# Altium schematic sheet Flash Programmer.SchDoc
size A4; SheetNumber: 4; SheetTotal: 9
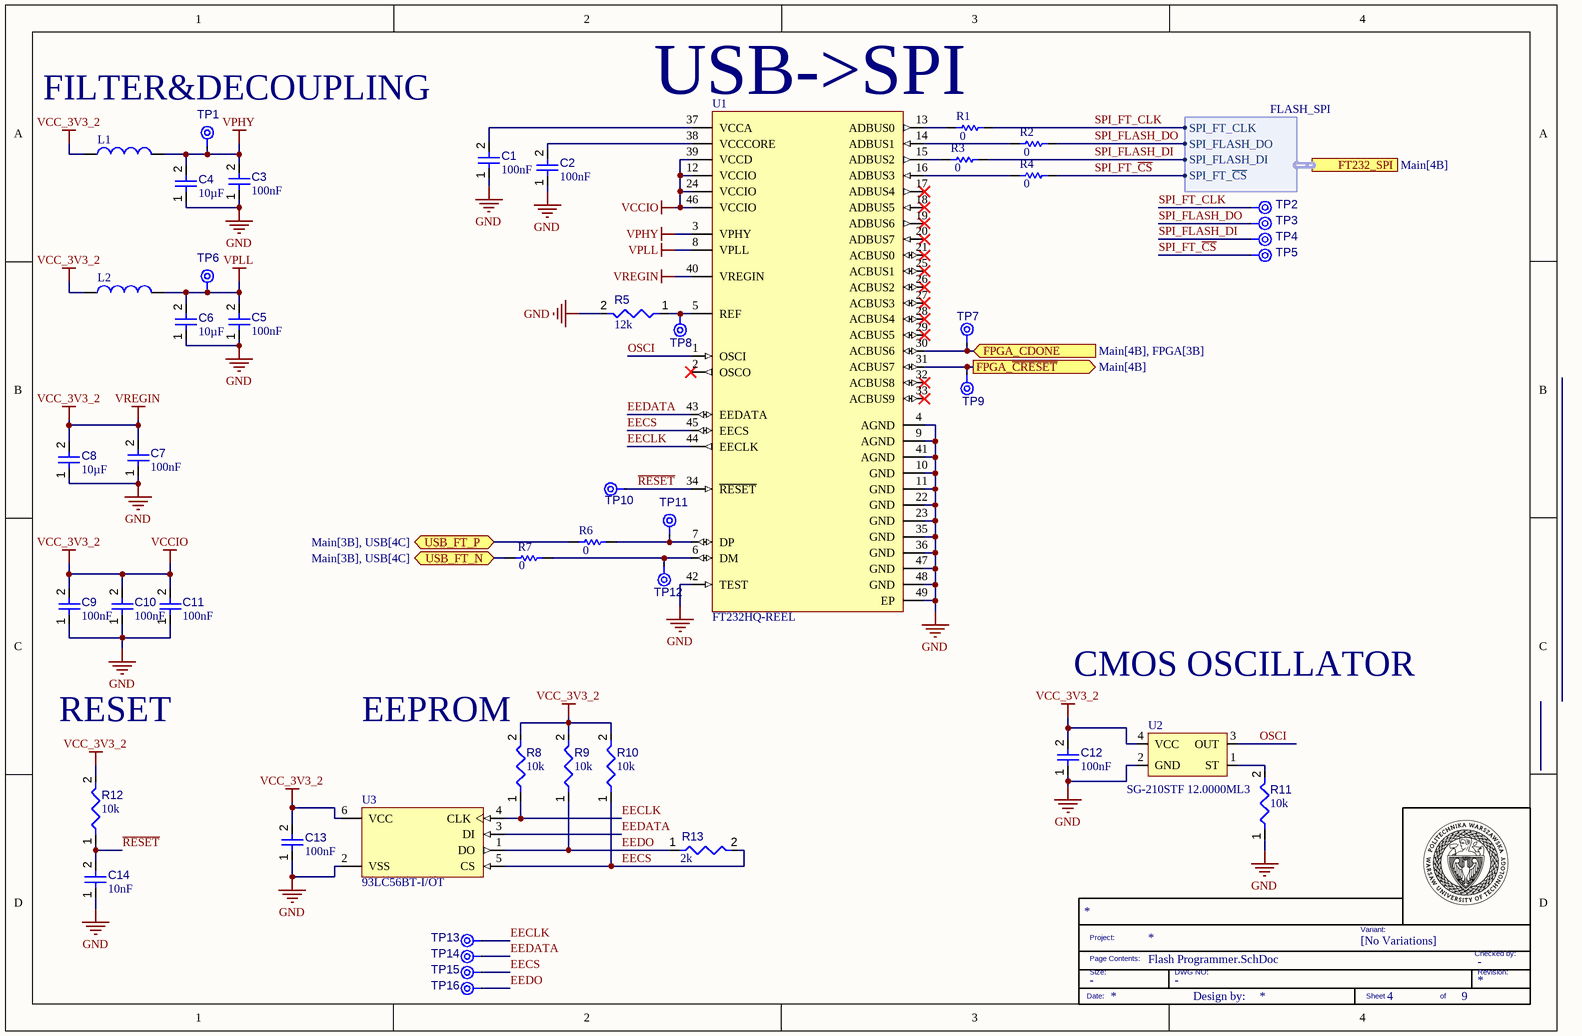
[diagram p0: Flash Programmer.SchDoc]

## Parts
*?  TITLE_BLOCK  (value not drawn)  (graphical)
C1  value 100nF  [FP-C0603C-CF-IPC_C]  (hidden comment: C0603C104K5RAC7411)
C2  value 100nF  [FP-C0603C-CF-IPC_C]  (hidden comment: C0603C104K5RAC7411)
C3  value 100nF  [FP-C0603C-CF-IPC_C]  (hidden comment: C0603C104K5RAC7411)
C4  value 10µF  [FP-GRM188-0_2-IPC_C]  (hidden comment: GRM188R61C106MA73D)
C5  value 100nF  [FP-C0603C-CF-IPC_C]  (hidden comment: C0603C104K5RAC7411)
C6  value 10µF  [FP-GRM188-0_2-IPC_C]  (hidden comment: GRM188R61C106MA73D)
C7  value 100nF  [FP-C0603C-CF-IPC_C]  (hidden comment: C0603C104K5RAC7411)
C8  value 10µF  [FP-GRM188-0_2-IPC_C]  (hidden comment: GRM188R61C106MA73D)
C9  value 100nF  [FP-C0603C-CF-IPC_C]  (hidden comment: C0603C104K5RAC7411)
C10  value 100nF  [FP-C0603C-CF-IPC_C]  (hidden comment: C0603C104K5RAC7411)
C11  value 100nF  [FP-C0603C-CF-IPC_C]  (hidden comment: C0603C104K5RAC7411)
C12  value 100nF  [FP-C0603C-CF-IPC_C]  (hidden comment: C0603C104K5RAC7411)
C13  value 100nF  [FP-C0603C-CF-IPC_C]  (hidden comment: C0603C104K5RAC7411)
C14  value 10nF  [CAPC1608X90X35LL10T15]  (hidden comment: GCM188R71H103KA37J)
L1  MPZ1608Y101BTA00  [FP-MPZ1608-0_8-IPC_C]  (value not drawn)
L2  MPZ1608Y101BTA00  [FP-MPZ1608-0_8-IPC_C]  (value not drawn)
R1  value 0  [RESC1005X40X25ML05T10]  (hidden comment: Resistor 0R 0402 63 mW)
R2  value 0  [RESC1005X40X25ML05T10]  (hidden comment: Resistor 0R 0402 63 mW)
R3  value 0  [RESC1005X40X25ML05T10]  (hidden comment: Resistor 0R 0402 63 mW)
R4  value 0  [RESC1005X40X25ML05T10]  (hidden comment: Resistor 0R 0402 63 mW)
R5  value 12k  [RESC1608X06N]  (hidden comment: RCS060312K0FKEA)
R6  value 0  [RESC1005X40X25ML05T10]  (hidden comment: Resistor 0R 0402 63 mW)
R7  value 0  [RESC1005X40X25ML05T10]  (hidden comment: Resistor 0R 0402 63 mW)
R8  value 10k  [RESC1608X05N]  (hidden comment: CRCW060310K0FKTC)
R9  value 10k  [RESC1608X05N]  (hidden comment: CRCW060310K0FKTC)
R10  value 10k  [RESC1608X05N]  (hidden comment: CRCW060310K0FKTC)
R11  value 10k  [RESC1608X05N]  (hidden comment: CRCW060310K0FKTC)
R12  value 10k  [RESC1608X05N]  (hidden comment: CRCW060310K0FKTC)
R13  value 2k  [RESC1608X06N]  (hidden comment: CRCW06032K00FKEAC)
TP1  TPAD6R  [TP06R]  (value not drawn)  (no BOM)
TP2  TPAD6R  [TP06R]  (value not drawn)  (no BOM)
TP3  TPAD6R  [TP06R]  (value not drawn)  (no BOM)
TP4  TPAD6R  [TP06R]  (value not drawn)  (no BOM)
TP5  TPAD6R  [TP06R]  (value not drawn)  (no BOM)
TP6  TPAD6R  [TP06R]  (value not drawn)  (no BOM)
TP7  TPAD6R  [TP06R]  (value not drawn)  (no BOM)
TP8  TPAD6R  [TP06R]  (value not drawn)  (no BOM)
TP9  TPAD6R  [TP06R]  (value not drawn)  (no BOM)
TP10  TPAD6R  [TP06R]  (value not drawn)  (no BOM)
TP11  TPAD6R  [TP06R]  (value not drawn)  (no BOM)
TP12  TPAD6R  [TP06R]  (value not drawn)  (no BOM)
TP13  TPAD6R  [TP06R]  (value not drawn)  (no BOM)
TP14  TPAD6R  [TP06R]  (value not drawn)  (no BOM)
TP15  TPAD6R  [TP06R]  (value not drawn)  (no BOM)
TP16  TPAD6R  [TP06R]  (value not drawn)  (no BOM)
U1  FT232HQ-REEL  [FP-QFN-48-IPC_A]
U2  SG-210STF 12.0000ML3  [SG-210STF 12.0000ML3-Footprint-1]
U3  93LC56BT-I/OT  [FP-C04-028-MFG]

## Ports
FPGA_CDONE (in, see Main[4B], FPGA[3B]), FPGA_~{CRESET} (out, see Main[4B]), FT232_SPI (harness FLASH_SPI, see Main[4B]), USB_FT_N (bidir, see Main[3B], USB[4C]), USB_FT_P (bidir, see Main[3B], USB[4C])

## Harnesses
FLASH_SPI: SPI_FT_CLK, SPI_FLASH_DO, SPI_FLASH_DI, SPI_FT_~{CS}

## Nets
GND: C1.1 C2.1 C3.1 C4.1 C5.1 C6.1 C7.1 C8.1 C9.1 C10.1 C11.1 C12.1 C13.1 C14.1 R5.2 R11.1 U1.4(AGND) U1.9(AGND) U1.10(GND) U1.11(GND) U1.22(GND) U1.23(GND) U1.35(GND) U1.36(GND) U1.41(AGND) U1.42(TEST) U1.47(GND) U1.48(GND) U1.49(EP) U2.2(GND) U3.2(VSS)
VCC_3V3_2: C7.2 C8.2 C9.2 C10.2 C11.2 C12.2 C13.2 L1.1 L2.1 R8.2 R9.2 R10.2 R12.2 U1.12(VCCIO) U1.24(VCCIO) U1.39(VCCD) U1.40(VREGIN) U1.46(VCCIO) U2.4(VCC) U3.6(VCC)  [also labelled VCCIO, VREGIN]
VPHY: C3.2 C4.2 L1.2 TP1.1(TP) U1.3(VPHY)
VPLL: C5.2 C6.2 L2.2 TP6.1(TP) U1.8(VPLL)
~{RESET}: C14.2 R12.1 TP10.1(TP) U1.34(~{RESET})
EECLK: R8.1 TP13.1(TP) U1.44(EECLK) U3.4(CLK)
EECS: R10.1 R13.2 TP15.1(TP) U1.45(EECS) U3.5(CS)
EEDATA: TP14.1(TP) U1.43(EEDATA) U3.3(DI)
EEDO: R9.1 R13.1 TP16.1(TP) U3.1(DO)
FPGA_~{CRESET}: TP9.1(TP) U1.31(ACBUS7) ; port FPGA_~{CRESET}
FPGA_CDONE: TP7.1(TP) U1.30(ACBUS6) ; port FPGA_CDONE
OSCI: U1.1(OSCI) U2.3(OUT)
SPI_FLASH_DI: R3.2 TP4.1(TP) ; port FT232_SPI.SPI_FLASH_DI
SPI_FLASH_DO: R2.2 TP3.1(TP) ; port FT232_SPI.SPI_FLASH_DO
SPI_FT_~{CS}: R4.2 TP5.1(TP) ; port FT232_SPI.SPI_FT_~{CS}
SPI_FT_CLK: R1.2 TP2.1(TP) ; port FT232_SPI.SPI_FT_CLK
USB_FT_N: R7.1 ; port USB_FT_N
USB_FT_P: R6.1 ; port USB_FT_P
NetC1_2: C1.2 U1.37(VCCA)
NetC2_2: C2.2 U1.38(VCCCORE)
NetR1_1: R1.1 U1.13(ADBUS0)
NetR2_1: R2.1 U1.14(ADBUS1)
NetR3_1: R3.1 U1.15(ADBUS2)
NetR4_1: R4.1 U1.16(ADBUS3)
NetR5_1: R5.1 TP8.1(TP) U1.5(REF)
NetR6_2: R6.2 TP11.1(TP) U1.7(DP)
NetR7_2: R7.2 TP12.1(TP) U1.6(DM)
NetR11_2: R11.2 U2.1(ST)

Not connected (* = marked no-connect by the designer): U1 2(OSCO)* 17(ADBUS4)* 18(ADBUS5)* 19(ADBUS6)* 20(ADBUS7)* 21(ACBUS0)* 25(ACBUS1)* 26(ACBUS2)* 27(ACBUS3)* 28(ACBUS4)* 29(ACBUS5)* 32(ACBUS8)* 33(ACBUS9)*

## Notes on the sheet
- FILTER&DECOUPLING
- USB->SPI
- CMOS OSCILLATOR
- RESET
- (near R8) EEPROM
- (in symbol CMP-003-000005-7) Variant:; Project:; [No Variations]; Checked by:; Page Contents:; Size:; DWG NO:; Revision:; Date:; Design by:; Sheet; of

## Library data of the parts
*? = CMP-003-000005-7: TITLEBLOCK; DWG NO: -; Size: -; Checked by: -; Design Item ID: TITLE_BLOCK; Source: TITLEBLOCK.SchLib
C1-C3 C5 C7 C9-C13 = CMP-001-00086-8: Ceramic Capacitor, Multilayer, Ceramic, 50V, 10% +Tol, 10% -Tol, X7R, 15% TC, 0.1uF, Surface Mount, 0603; Capacitor Type: Ceramic; Max Operating Temperature: 125°C; Case/Package: 0603; Pins: 2; Min Operating Temperature: -55°C; RoHS Compliant: Yes; Mounting Technology: Surface Mount
C4 C6 C8 = CMP-001-00241-5: Ceramic Capacitor, Multilayer, Ceramic, 16V, 20% +Tol, 20% -Tol, X5R, 15% TC, 10uF, Surface Mount, 0603; Min Operating Temperature: -55°C; Capacitor Type: Ceramic; RoHS Compliant: Yes; Max Operating Temperature: 85°C; Case/Package: 0603; Mounting Technology: Surface Mount; Pins: 2
C14 = CMP-001-00231-2: Ceramic Capacitor, Multilayer, Ceramic, 50V, 10% +Tol, 10% -Tol, X7R, 15% TC, 0.01uF, Surface Mount, 0603; Min Operating Temperature: -55°C; Voltage Rating: 50V; Max Operating Temperature: 125°C; Tolerance: 10%; Capacitor Type: Ceramic; Mounting Technology: Surface Mount; RoHS Compliant: Yes; Case/Package: 0603; Pins: 2
L1 L2 = CMP-006-00024-5: Ferrite Chip, 1 Function(s), 2A, 2 Pin(s); Tolerance: 25%; Current Rating: 2A; RoHS Compliant: Yes; Pins: 2; Max Operating Temperature: 125°C; Mounting Technology: Surface Mount; Case/Package: 0603; Min Operating Temperature: -55°C; Max Current Rating: 2A
R1-R4 R6 R7 = CMP-009-00004-6: Chip Resistor, 0 Ohm, 0.063 W, -55 to 155 degC, 0402 (1005 Metric); Power: 63mW; Voltage Rating: 50V; Case/Package: 0402; Max Operating Temperature: 155°C; RoHS Compliant: True; Mounting Technology: SM; Min Operating Temperature: -55°C; Pins: 2
R5 = CMP-009-00198-2: Fixed Resistor, Metal Glaze/thick Film, 0.25W, 12000ohm, 75V, 1% +/-Tol, 100ppm/Cel, Surface Mount, 0603; Power: 250mW; Pins: 2; Tolerance: 1%; Voltage Rating: 75V; Case/Package: 0603
R8-R12 = CMP-009-00187-2: Fixed Resistor, Metal Glaze/thick Film, 0.1W, 10000ohm, 75V, 1% +/-Tol, 100ppm/Cel, Surface Mount, 0603; Power: 100mW; Voltage Rating: 75V; Case/Package: 0603; Tolerance: 1%; Min Operating Temperature: -55°C; Mounting Technology: Surface Mount; Max Operating Temperature: 155°C; RoHS Compliant: No; Pins: 2
R13 = CMP-009-00199-2: Fixed Resistor, Metal Glaze/thick Film, 0.1W, 2000ohm, 75V, 1% +/-Tol, 100ppm/Cel, Surface Mount, 0603; Power: 100mW; Pins: 2; RoHS Compliant: Yes; Tolerance: 1%; Max Operating Temperature: 155°C; Case/Package: 0603; Mounting Technology: Surface Mount; Min Operating Temperature: -55°C
TP1-TP16 = CMP-00028-00002-3: 0.6mm round; Pins: 1
U1 = CMP-031-00017-2: USB Bus Controller, CMOS; Max Supply Voltage: 1.98V; Min Supply Voltage: 1.62V; Min Operating Temperature: -40°C; Max Operating Temperature: 85°C; RoHS Compliant: Yes; Pins: 48; Case/Package: HVQCCN
U2 = CMP-003-00030-6: CMOS Output Clock Oscillator, 12MHz Nom; Load Capacitance: 15pF; Frequency: 12MHz; Max Operating Temperature: 85°C; Min Operating Temperature: -40°C; Pins: 4
U3 = CMP-031-00019-2: EEPROM, 128X16, Serial, CMOS, PDSO6